# EAGLE design 214_oled_B (EAGLE 9.6.2)
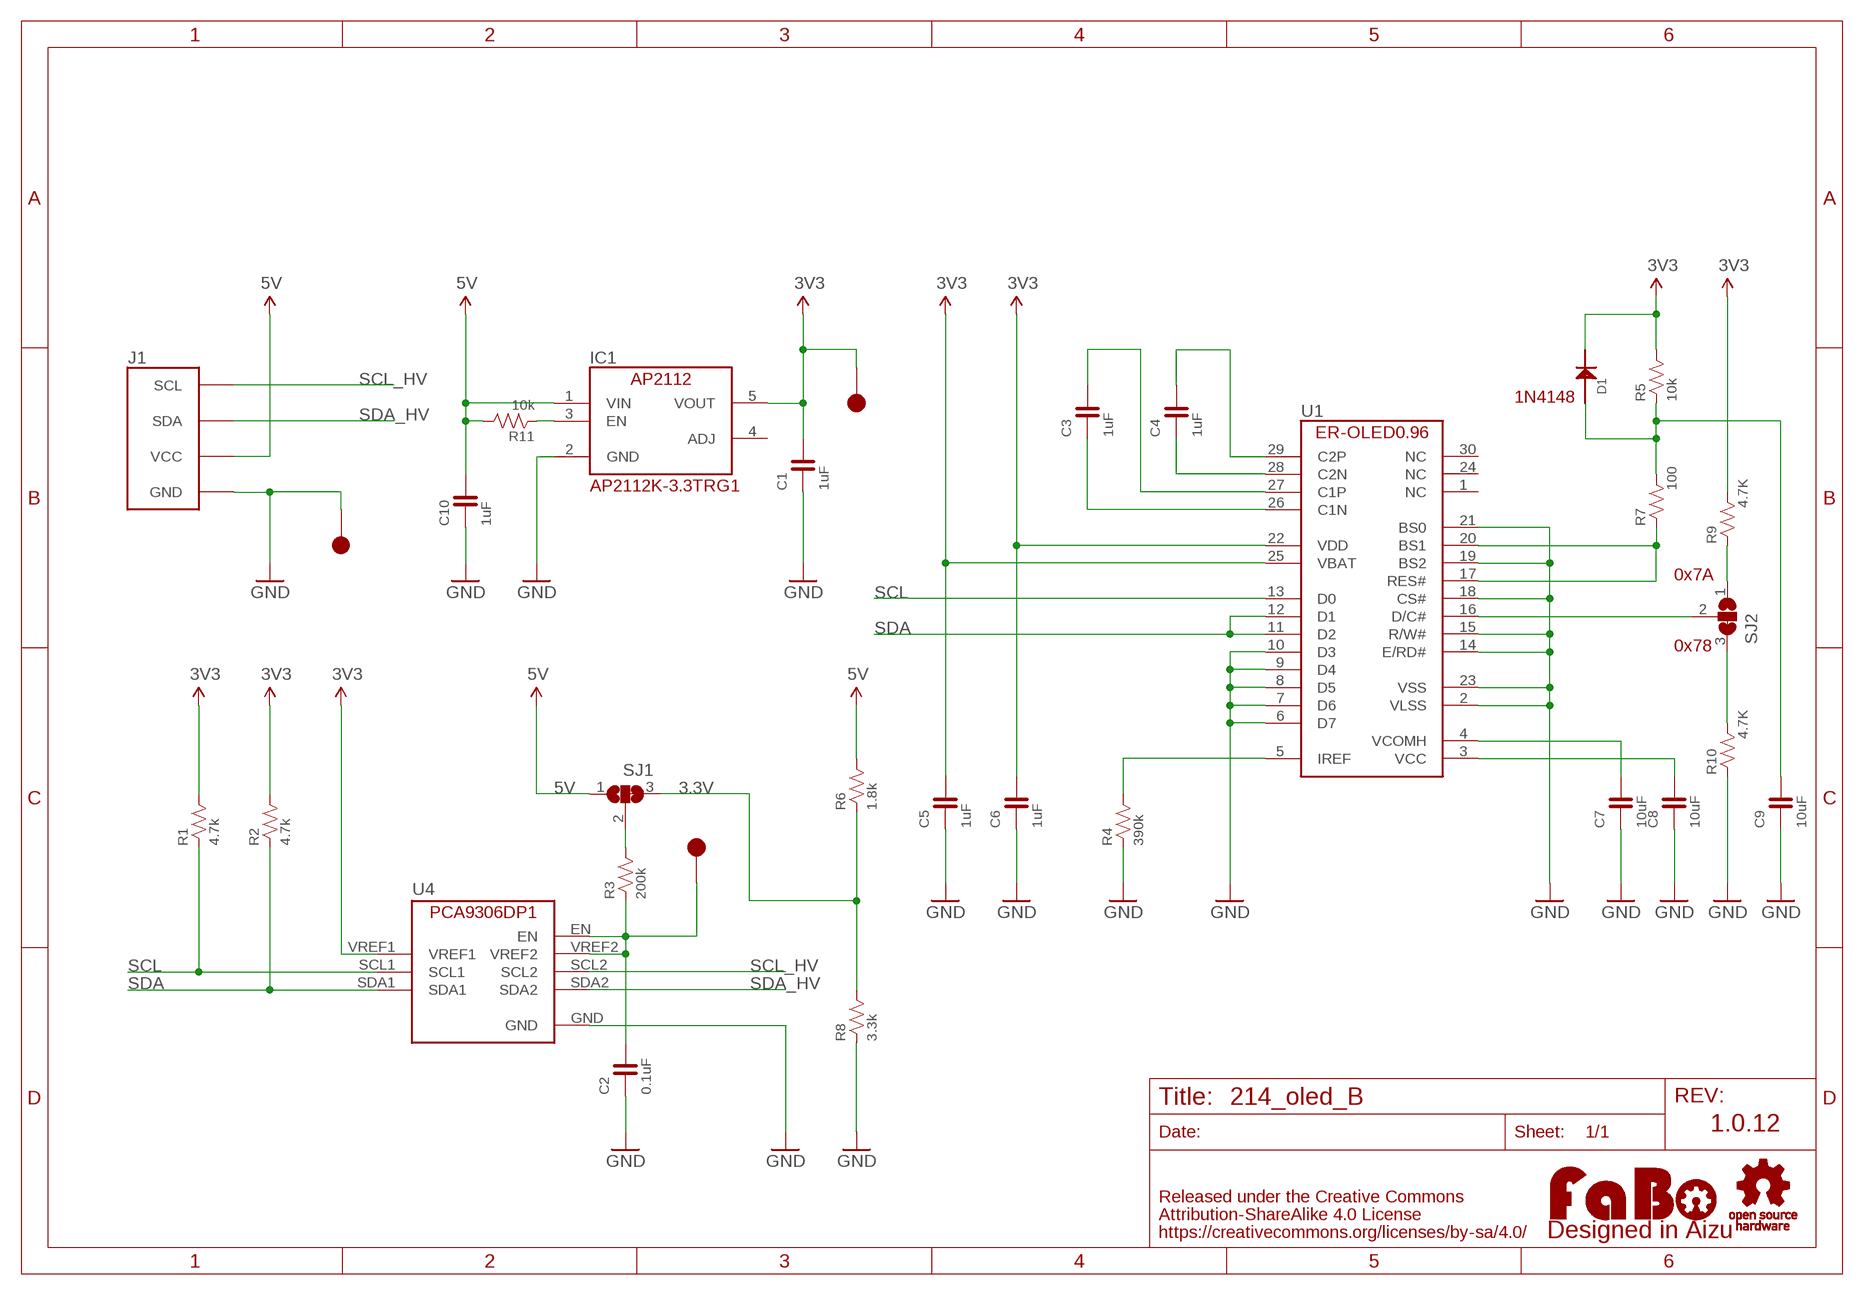
[diagram p0: schematic, sheet 1]

## Parts
C1  1uF  CAPACITOR-0603  [0603]
C2  0.1uF  CAPACITOR-0603  [0603]
C3  1uF  CAPACITOR-0603  [0603]
C4  1uF  CAPACITOR-0603  [0603]
C5  1uF  CAPACITOR-0603  [0603]
C6  1uF  CAPACITOR-0603  [0603]
C7  10uF  CAPACITOR-0603  [0603]
C8  10uF  CAPACITOR-0603  [0603]
C9  10uF  CAPACITOR-0603  [0603]
C10  1uF  CAPACITOR-0603  [0603]
D1  1N4148  [1N4148W]
IC1  AP2112K-3.3TRG1  [SOT-23-5]
J1  FABO_BRICK_I2C-OLED  [FABO_BRICK_I2C_OLED]
LOGO1  LOGO_FABO-M_BOTTOM  [LOGO_FABO_M_BOTTOM]
R1  4.7k  RESISTOR-0603  [0603]
R2  4.7k  RESISTOR-0603  [0603]
R3  200k  RESISTOR-0603  [0603]
R4  390k  RESISTOR-0603  [0603]
R5  10k  RESISTOR-0603  [0603]
R6  1.8k  RESISTOR-0603  [0603]
R7  100  RESISTOR-0603  [0603]
R8  3.3k  RESISTOR-0603  [0603]
R9  4.7K  RESISTOR-0603  [0603]
R10  4.7K  RESISTOR-0603  [0603]
R11  10k  RESISTOR-0603  [0603]
SJ1  SJ2W  [SJ_2]
SJ2  SJ2W  [SJ_2]
TP1  TP-15  [TP-15]
TP2  TP-15  [TP-15]
TP5  TP-15  [TP-15]
U1  ER-OLED0.96-1ER-CON30HT-1  [ER-CON30HT-1]
U4  PCA9306DP1  [TSSOP8]
U$2  LOGO_OSHW-M_BOTTOM  [LOGO_OSHW_M_BOTTOM]

## Nets
3.3V: R6.1 R8.2 SJ1.3
3V3: C1.2 C5.2 C6.2 D1.CATHODE IC1.5(VOUT) R1.2 R2.2 R5.2 R9.2 TP5.1 U1.22(VDD) U1.25(VBAT) U4.VREF1
5V: C10.2 IC1.1(VIN) J1.VCC R6.2 R11.2 SJ1.1
D/C: SJ2.2 U1.16(D/C#)
GND: C1.1 C2.1 C5.1 C6.1 C7.1 C8.1 C9.1 C10.1 IC1.2(GND) J1.GND R4.1 R8.1 R10.1 TP1.1 U1.2(VLSS) U1.6(D7) U1.7(D6) U1.8(D5) U1.9(D4) U1.10(D3) U1.14(E/RD#) U1.15(R/W#) U1.18(CS#) U1.19(BS2) U1.21(BS0) U1.23(VSS) U4.GND
N$1: C3.2 U1.27(C1P)
N$2: C3.1 U1.26(C1N)
N$3: C4.1 U1.28(C2N)
N$4: C4.2 U1.29(C2P)
N$5: R4.2 U1.5(IREF)
N$6: C7.2 U1.4(VCOMH)
N$7: C8.2 U1.3(VCC)
N$8: C2.2 R3.1 TP2.1 U4.EN U4.VREF2
N$9: R3.2 SJ1.2
N$10: R7.1 U1.17(RES#) U1.20(BS1)
N$11: IC1.3(EN) R11.1
N$12: C9.2 D1.ANODE R5.1 R7.2
N$14: R10.2 SJ2.3
N$15: R9.1 SJ2.1
SCL: R1.1 U1.13(D0) U4.SCL1
SCL_HV: J1.SCL U4.SCL2
SDA: R2.1 U1.11(D2) U1.12(D1) U4.SDA1
SDA_HV: J1.SDA U4.SDA2
Unconnected: IC1.4(ADJ) U1.1(NC) U1.24(NC) U1.30(NC)

## Notes on the sheet
- 1N4148
- AP2112K-3.3TRG1
- 0x7A
- 0x78
- 1.0.12

## Library data of the parts
C1-C10 = FaBo-Capacitor:CAPACITOR: CAPACITOR
D1 = FaBo-Diode:1N4148
IC1 = FaBo-Supply:AP2112
J1 = FaBo-Template:FABO_BRICK_I2C: FaBo Brick I2C
LOGO1 = component:LOGO_FABO
R1-R11 = FaBo-Resistors:RESISTOR: RESISTOR
SJ1 SJ2 = jumper:SJ2W: SMD solder JUMPER
TP1 TP2 TP5 = FaBo-Supply:TP
U1 = FaBo-Display:ER-OLED0.96-1
U4 = FaBo-LevelTranslator:PCA9306DP1
U$2 = component:LOGO_OSHW

## Board
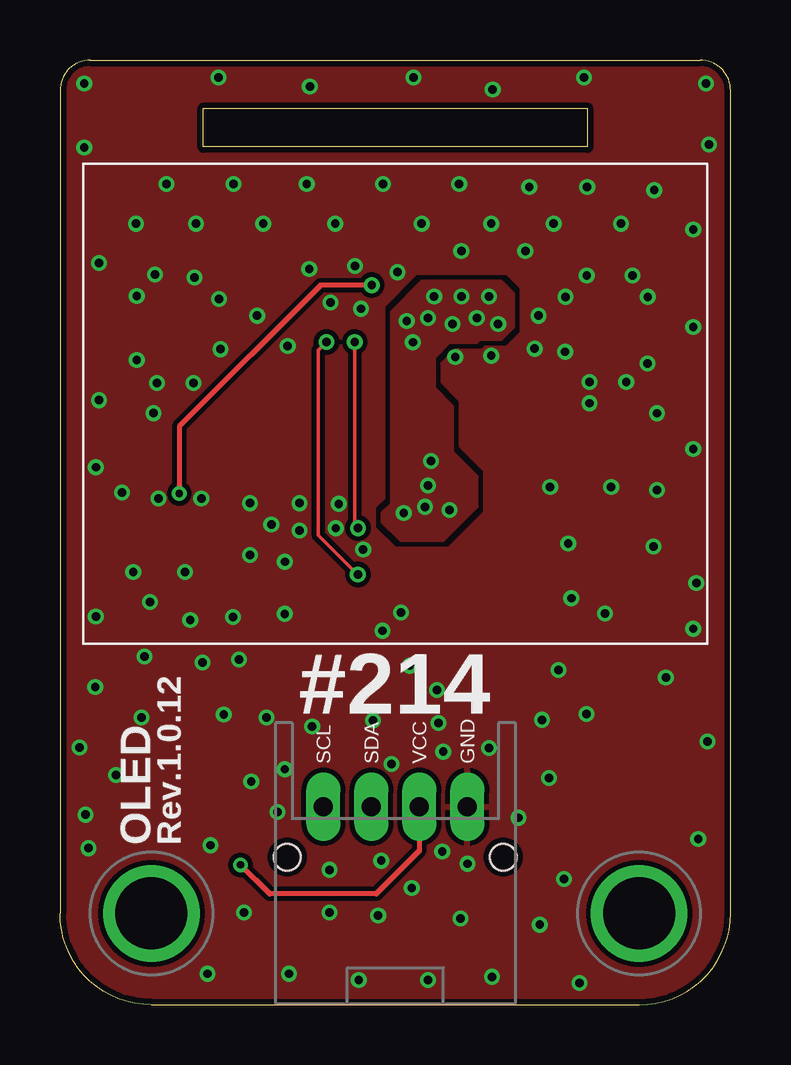
[diagram p1: board, top side]
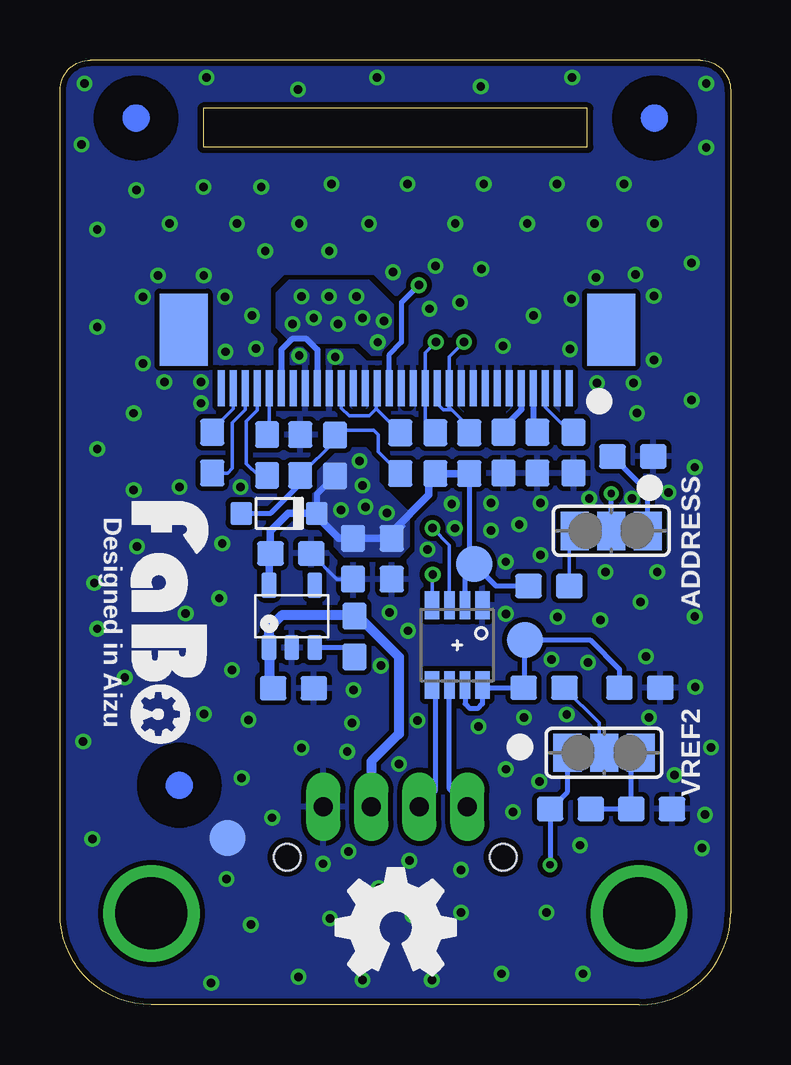
[diagram p2: board, bottom side, seen from below]

Size 27.94 x 39.37 mm. Coordinates in mm from the lower left corner, seen from the top.
Outline: 5.97,37.35 21.97,37.35 21.97,35.75 5.97,35.75 5.97,37.35
Copper layers (1*16): Top 0.035mm / dielectric 1.6mm / Bottom 0.035mm
Design rules "PCBway": minimum track width 6mil, minimum drill 12mil, track to track 6mil, track to pad 6mil, pad to pad 6mil, via to via 6mil, smd to smd 6mil, copper to edge 10mil, drill to drill 10mil, minimum pad ring 10mil, minimum via ring 6mil, stop-mask expansion 2mil, vias tented up to drill 100mil, thermal gap 8mil
bRestrict: area 9.4,24.9 to 9.6,26.1; area 9.9,24.9 to 10.1,26.1; area 10.4,24.9 to 10.6,26.1; area 10.9,24.9 to 11.1,26.1; area 13.4,24.9 to 13.6,26.1; area 15.4,24.9 to 15.6,26.1

### Footprints (pad centres in the part's own frame; a part is rotated, then mirrored left to right if it is on the bottom)
0603 = smd 1.1 x 1: 1 -0.85,0; 2 0.85,0
1N4148W = smd 0.9 x 0.95: ANODE 0,0; CATHODE 3.15,0
SOT-23-5 = smd 0.6 x 1.05: 1 -0.95,-1.3; 2 0,-1.3; 3 0.95,-1.3; 4 0.95,1.3; 5 -0.95,1.3
FABO_BRICK_I2C_OLED = drill 0.8 pad 1.422 long: GND 3,-10.795; SCL -3,-10.795; SDA -1,-10.795; VCC 1,-10.795 | drill 3 pad 3.81: P$1 -10.16,-15.24; P$2 10.16,-15.24 | hole 1.1: -4.5,-12.895; 4.5,-12.895
SJ_2 = smd 1.168 x 1.6: 1 -1.524,0; 2 0,0; 3 1.524,0
TP-15 = smd 1.5 x 1.5: 1 0,0
ER-CON30HT-1 = smd 0.3 x 1.5 bottom: 1 7,-0.23; 2 6.5,-0.23; 3 6,-0.23; 4 5.5,-0.23; 5 5,-0.23; 6 4.5,-0.23; 7 4,-0.23; 8 3.5,-0.23; 9 3,-0.23; 10 2.5,-0.23; 11 2,-0.23; 12 1.5,-0.23; 13 1,-0.23; 14 0.5,-0.23; 15 0,-0.23; 16 -0.5,-0.23; 17 -1,-0.23; 18 -1.5,-0.23; 19 -2,-0.23; 20 -2.5,-0.23; 21 -3,-0.23; 22 -3.5,-0.23; 23 -4,-0.23; 24 -4.5,-0.23; 25 -5,-0.23; 26 -5.5,-0.23; 27 -6,-0.23; 28 -6.5,-0.23; 29 -7,-0.23; 30 -7.5,-0.23 | smd 2 x 3 bottom: 31 -9.07,-2.67; 32 8.74,-2.67
TSSOP8 = smd 0.6 x 1.15: EN -1.05,1.663; GND -1.05,-1.663; SDA1 1.05,-1.663; SDA2 1.05,1.663 | smd 0.45 x 1.15: SCL1 0.325,-1.663; SCL2 0.325,1.663; VREF1 -0.325,-1.663; VREF2 -0.325,1.663

### Placement (x,y rotation side)
C1  18.32,18.81 180 bottom
C2  3.78,13.21 180 bottom
C3  19.31,22.91 270 bottom
C4  21.6,23.01 90 bottom
C5  15.73,18.59 90 bottom
C6  14.12,18.59 90 bottom
C7  8.05,23.01 90 bottom
C8  6.54,23.01 90 bottom
C9  17.93,22.91 270 bottom
C10  18.21,13.19 180 bottom
D1  20.39,20.48 0 bottom
IC1  18.28,16.19 0 bottom
J1  13.97,19.05 0 top
LOGO1  25.37,15.93 90 top
R1  12.3,22.99 270 bottom
R2  10.89,22.99 270 bottom
R3  7.77,13.21 0 bottom
R4  9.46,23.01 90 bottom
R5  16.48,22.89 270 bottom
R6  6.67,8.16 180 bottom
R7  13.76,22.99 270 bottom
R8  3.29,8.16 180 bottom
R9  7.57,17.45 180 bottom
R10  4.07,22.85 180 bottom
R11  15.67,15.35 90 bottom
SJ1  5.27,10.51 0 bottom
SJ2  4.97,19.75 0 bottom
TP1  20.97,6.95 0 bottom
TP2  8.57,15.2 0 bottom
TP5  10.68,18.37 0 bottom
U1  13.72,25.47 180 top
U4  11.39,14.99 180 bottom
U$2  13.94,3.23 0 top
U$3  [MARK_POINT_3MM]  24.77,36.95 0 bottom
U$4  [MARK_POINT_3MM]  22.97,9.15 0 bottom
U$5  [MARK_POINT_3MM]  3.17,36.95 0 bottom

### Tracks (layer width: path | path; a pad name or v marks a point on that pad's centre or on a via)
3.3V
  Bottom 0.203: R6.1 R8.2 4.14,10.11 SJ1.3
3V3  (via drill 0.35)
  Bottom 0.152: 17.18,20.48 D1.CATHODE | 13.62,19.94 C6.2
  Bottom 0.203: R2.2 10.89,18.58 10.71,18.39 | 10.71,18.39 TP5.1 9.76,17.45 R9.2 | U4.VREF1 11.07,18.04 10.71,18.39
  Bottom 0.254: C5.2 | R5.2 17.24,21.28 D1.CATHODE | U1.22 17.22,27.3 17.67,27.75 18.27,27.75 18.72,27.3 U1.25
  Bottom 0.305: IC1.5 19.23,18.75 C1.2 19.17,19.73 18.42,20.48 D1.CATHODE 17.24,20.35 16.33,19.44 C5.2 C6.2 14.12,19.7 12.57,21.25 12.57,21.87 R1.2 R2.2
  other vias: 14.45,28.5 15.46,22.66 14.32,20.5 16.23,20.62 14.7,27.61 18.26,28.37 17.37,28.62 16.35,28.37 15.34,28.62 17.88,29.51 16.73,29.51 15.59,29.51 15.34,21.64 15.21,20.75
  pour Top (isolate 0.203, no thermals): 13.81,28.88 13.81,20.88 13.43,20.5 13.43,20.12 14.19,19.35 15.97,19.35 17.37,20.75 17.37,22.02 16.35,23.04 16.35,24.94 15.59,25.7 15.59,26.97 16.23,27.61 17.37,27.61 17.5,27.74 18.38,27.74 18.89,28.24 18.89,29.64 18.38,30.15 15.08,30.15
  pour Bottom (isolate 0.203, no thermals): 13.81,27.74 13.81,28.88 15.08,30.15 18.38,30.15 18.89,29.64 18.89,28.24 18.38,27.74 17.5,27.74 17.37,27.61 15.46,27.61 14.96,27.1 14.45,27.1
  pour Bottom (isolate 0.203, no thermals): 13.43,20.5 14.7,21.77 14.7,22.66 15.21,23.16 16.23,23.16 17.37,22.02 17.37,20.75 16.48,19.86 16.48,19.1 16.1,18.72 13.81,18.72 13.43,19.1
5V  (via drill 0.3)
  Top 0.203: J1.VCC 14.97,6.41 13.18,4.62 8.73,4.62 v7.52,5.84
  Bottom 0.203: SJ1.1 6.79,8.89 R6.2 v7.52,5.84
  Bottom 0.406: C10.2 19.26,13.39 19.26,13.62 19.23,13.65 IC1.1 19.23,15.69 18.67,16.25 15.72,16.25 R11.2 15.52,16.2 13.82,14.5 13.82,11.3 14.97,10.15 J1.VCC
D/C  (via drill 0.3, 0.35)
  Top 0.203: v4.97,21.31 4.97,24.1 10.86,29.99 v12.99,29.99
  Bottom 0.203: v12.99,29.99 13.71,29.27 13.71,27.61 14.22,27.1 U1.16 | SJ2.2 v4.97,21.31
GND  (via drill 0.35)
  Bottom 0.152: 2.89,13.25 C2.1 | C9.1 17.74,23.95 | C1.1 16.4,17.74 C5.1
  Bottom 0.254: 17.93,23.89 C9.1
  other vias: 4.04,25.91 19.94,28.72 12.29,30.78 11.47,32.55 15.07,32.55 17.97,32.55 20.57,32.55 24.87,21.45 24.73,19.1 5.21,18.04 20.77,13.95 25.24,13.64 8.47,32.55 10.38,30.66 5.67,32.55 23.37,32.55 1.62,25.2 3.96,30.43 26.39,32.31 26.39,28.24 24.87,24.65 3.2,26.87 6.15,1.3 9.55,1.3 12.45,1.04 15.34,1.04 21.64,0.92 1.47,13.25 7.67,3.85 19.99,3.34 1.49,16.18 1.49,22.4 20.37,9.45 9.36,16.29 6.27,6.65 7.92,20.9 15.77,11.75 15.97,10.55 17.97,27.05 16.47,27 12.54,29.01 9.98,20.9 3.75,16.78 14.21,16.35 3.17,32.55 21.31,16.94 21.18,19.23 11.62,20.88 11.27,29.26 9.49,27.45 8.22,28.72 6.69,27.32 3.9,24.65 3.05,18.04 7.21,16.17 3.52,14.52 15.71,13.12 21.05,27.21 19.78,27.34 26.59,6.91 26.97,10.97 1.19,6.53 5.43,16.04 10.51,11.59 6.82,12.1 7.97,9.31 17.87,10.71 16.98,5.88 13.38,6.01 11.23,5.63 9.07,8.04 11.23,3.85 15.93,6.39 16.69,3.6 11.49,19.86 12.63,18.97 13.44,15.59 22.07,25.96 14.07,30.53 22.07,25.07 23.59,25.96 24.48,26.72 24.49,29.5 23.85,30.39 21.95,30.39 21.06,29.5 22.97,21.58 20.42,21.58 13.81,10.04 5.61,30.3 6.63,29.41 3.2,29.54 5.57,25.91 16.72,31.41 19.39,31.41 4.44,34.2 7.23,34.2 10.28,34.2 13.46,34.2 16.63,34.2 19.55,34.07 21.97,34.07 24.76,33.95 27.05,35.85 1.01,35.72 1.01,38.39 26.92,38.39 21.84,38.65 14.73,38.65 6.6,38.65 10.41,38.27 18.03,38.14 26.39,15.67 7.46,14.39 5.94,14.26 3.4,11.98 7.92,18.75 9.98,19.76 14.57,14.13 13.05,11.85 8.6,11.98 2.59,21.35 4.11,21.1 5.89,21.1 8.81,20.02 9.37,18.46 2.34,9.58 1.07,7.93 9.36,9.82 14.66,4.87 13.26,3.72 18.01,1.17 21.01,5.25 20.09,11.88 19.1,7.8 26.39,23.16 26.51,17.58 1.62,30.91 0.81,10.72 22.7,16.31 21.94,12.12
  pour Bottom (isolate 0.203, rank 6): -0.03,39.42 27.91,39.42 27.91,0.05 -0.03,0.05
  pour Top (isolate 0.203, rank 6): -0.03,39.42 27.91,39.42 27.91,0.05 -0.03,0.05
N$1
  Bottom 0.152: U1.27 19.72,24.77 20.17,24.32 20.17,22.55 19.68,22.06 C3.2
N$2
  Bottom 0.152: U1.26 19.22,23.85 C3.1
N$3
  Bottom 0.152: U1.28 20.22,24.8 20.77,24.25 20.77,22.35 20.96,22.16 C4.1
N$4
  Bottom 0.152: C4.2 21.6,23.95 20.72,24.83 U1.29
N$5
  Bottom 0.254: U1.5 8.72,24.8 9.46,24.06 R4.2
N$6
  Bottom 0.152: C7.2 8.11,23.91
  Bottom 0.254: U1.4 8.22,24.03 8.11,23.91
N$7
  Bottom 0.152: C8.2 6.68,23.86 7.72,24.9 U1.3
N$8
  Bottom 0.203: U4.VREF2 11.07,12.54 10.89,12.37 10.51,12.37 10.34,12.54 10.34,13.13 U4.EN 10.22,13.21 R3.1 8.57,13.26 TP2.1 5.85,15.2 4.63,13.98 C2.2
N$9
  Bottom 0.152: SJ1.2 5.47,10.71 5.47,11.75 R3.2
N$10
  Bottom 0.152: U1.17 14.76,25.66 14.76,24.84 | R7.1 14.76,24.84 | U1.20 16.22,24.87 15.89,24.54 15.06,24.54 14.76,24.84
N$11
  Bottom 0.203: R11.1 16.06,14.89 IC1.3
N$12
  Bottom 0.152: C9.2 16.48,23.51 R5.1 16.27,23.95 14.87,23.95 14.67,23.75 14.67,23.05 R7.2
  Bottom 0.203: D1.ANODE 19.16,20.48 17.93,21.71 C9.2
N$14
  Bottom 0.203: SJ2.3 3.45,21.38 R10.2
N$15
  Bottom 0.152: SJ2.1 6.72,19.52 R9.1
SCL  (via drill 0.35)
  Top 0.152: v12.42,19.86 12.28,20 v12.28,27.62
  Bottom 0.152: R1.1 12.43,23.71 12.72,24 U1.13 12.72,27.18 v12.28,27.62 | U4.SCL1 11.71,19.16 v12.42,19.86
SCL_HV
  Bottom 0.203: J1.SCL 11.71,9 U4.SCL2
SDA  (via drill 0.35)
  Top 0.152: v11.11,27.62 10.77,27.28 10.77,19.57 v12.41,17.93
  Bottom 0.152: R2.1 10.89,24.07 11.62,24.8 | 11.62,24.8 11.77,24.95 11.77,25.65 U1.11 11.72,27 v11.11,27.62 | U1.12 12.22,25.05 11.97,24.8 11.62,24.8 | v12.41,17.93 12.44,17.9 U4.SDA1
SDA_HV
  Bottom 0.203: U4.SDA2 12.31,13.2 12.31,8.91 J1.SDA

### Text on the board
tPlace: #214 | OLED | Rev.1.0.12
bPlace: ADDRESS | Designed in Aizu | VREF2